# Altium schematic sheet exp2.SchDoc
size A4
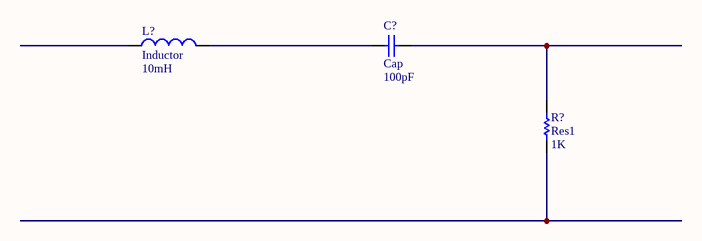
[diagram p0: exp2.SchDoc]

## Parts
C?  Cap  value 100pF  [RAD-0.3]
L?  Inductor  value 10mH  [0402-A]
R?  Res1  value 1K  [AXIAL-0.3]

## Nets
NetC?_1: C?.1 L?.2
NetC?_2: C?.2 R?.2

Not connected (* = marked no-connect by the designer): L? 1; R? 1

## Library data of the parts
C? = Cap: Capacitor; Published: 8-Jun-2000; LatestRevisionDate: 17-Jul-2002; LatestRevisionNote: Re-released for DXP Platform.; PackageReference: RAD-0.3; Publisher: Altium Limited; PackageDescription: Radial Cap, Thru-Hole; 2 Leads; 0.3 in Pin Spacing
L? = Inductor: Code_IEC: 1005; Published: 8-Jun-2000; LatestRevisionDate: 29-May-2009; LatestRevisionNote: IPC-7351 Footprint Added.; PackageReference: 0402-A; Publisher: Altium Limited; PackageDescription: Chip Inductor; Code_JEITA: 0402
R? = Res1: Resistor; Published: 8-Jun-2000; LatestRevisionDate: 17-Jul-2002; LatestRevisionNote: Re-released for DXP Platform.; PackageReference: AXIAL-0.3; Publisher: Altium Limited; PackageDescription: Axial Device, Thru-Hole; 2 Leads; 0.3 in Pin Spacing